# Altium project EE463_Project.PrjPcb
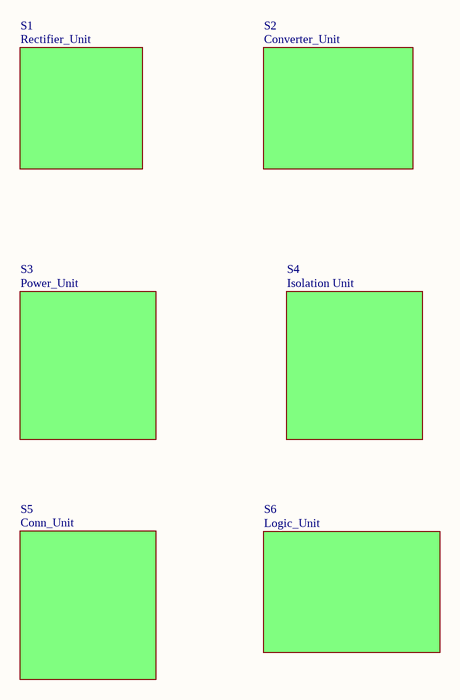
[diagram p0: EE463_Sch.SchDoc]
6 sheets, 40 parts. Net scope: flat (ports and power ports of the same name join across sheets).
Board file: EE463_PCB.PcbDoc
Sheets:
  EE463_Sch.SchDoc
    S2 = Converter_Unit.SchDoc
    S3 = Power_Unit.SchDoc
    S6 = Logic_Unit.SchDoc
    S5 = Conn_Unit.SchDoc
    S4 = Isolation Unit.SchDoc

## Sheet EE463_Sch.SchDoc
size A3

### Sub-sheets
S1 = Rectifier_Unit (file not in this document): no entries
S2 = Converter_Unit: no entries
S3 = Power_Unit: no entries
S4 = Isolation Unit: no entries
S5 = Conn_Unit: no entries
S6 = Logic_Unit: no entries

### Notes on the sheet
- Title
- Size:
- Date:
- A3
- Number:
- Time:
- Revision:
- Sheet
- of
- File:

## Sheet Converter_Unit.SchDoc
size A3
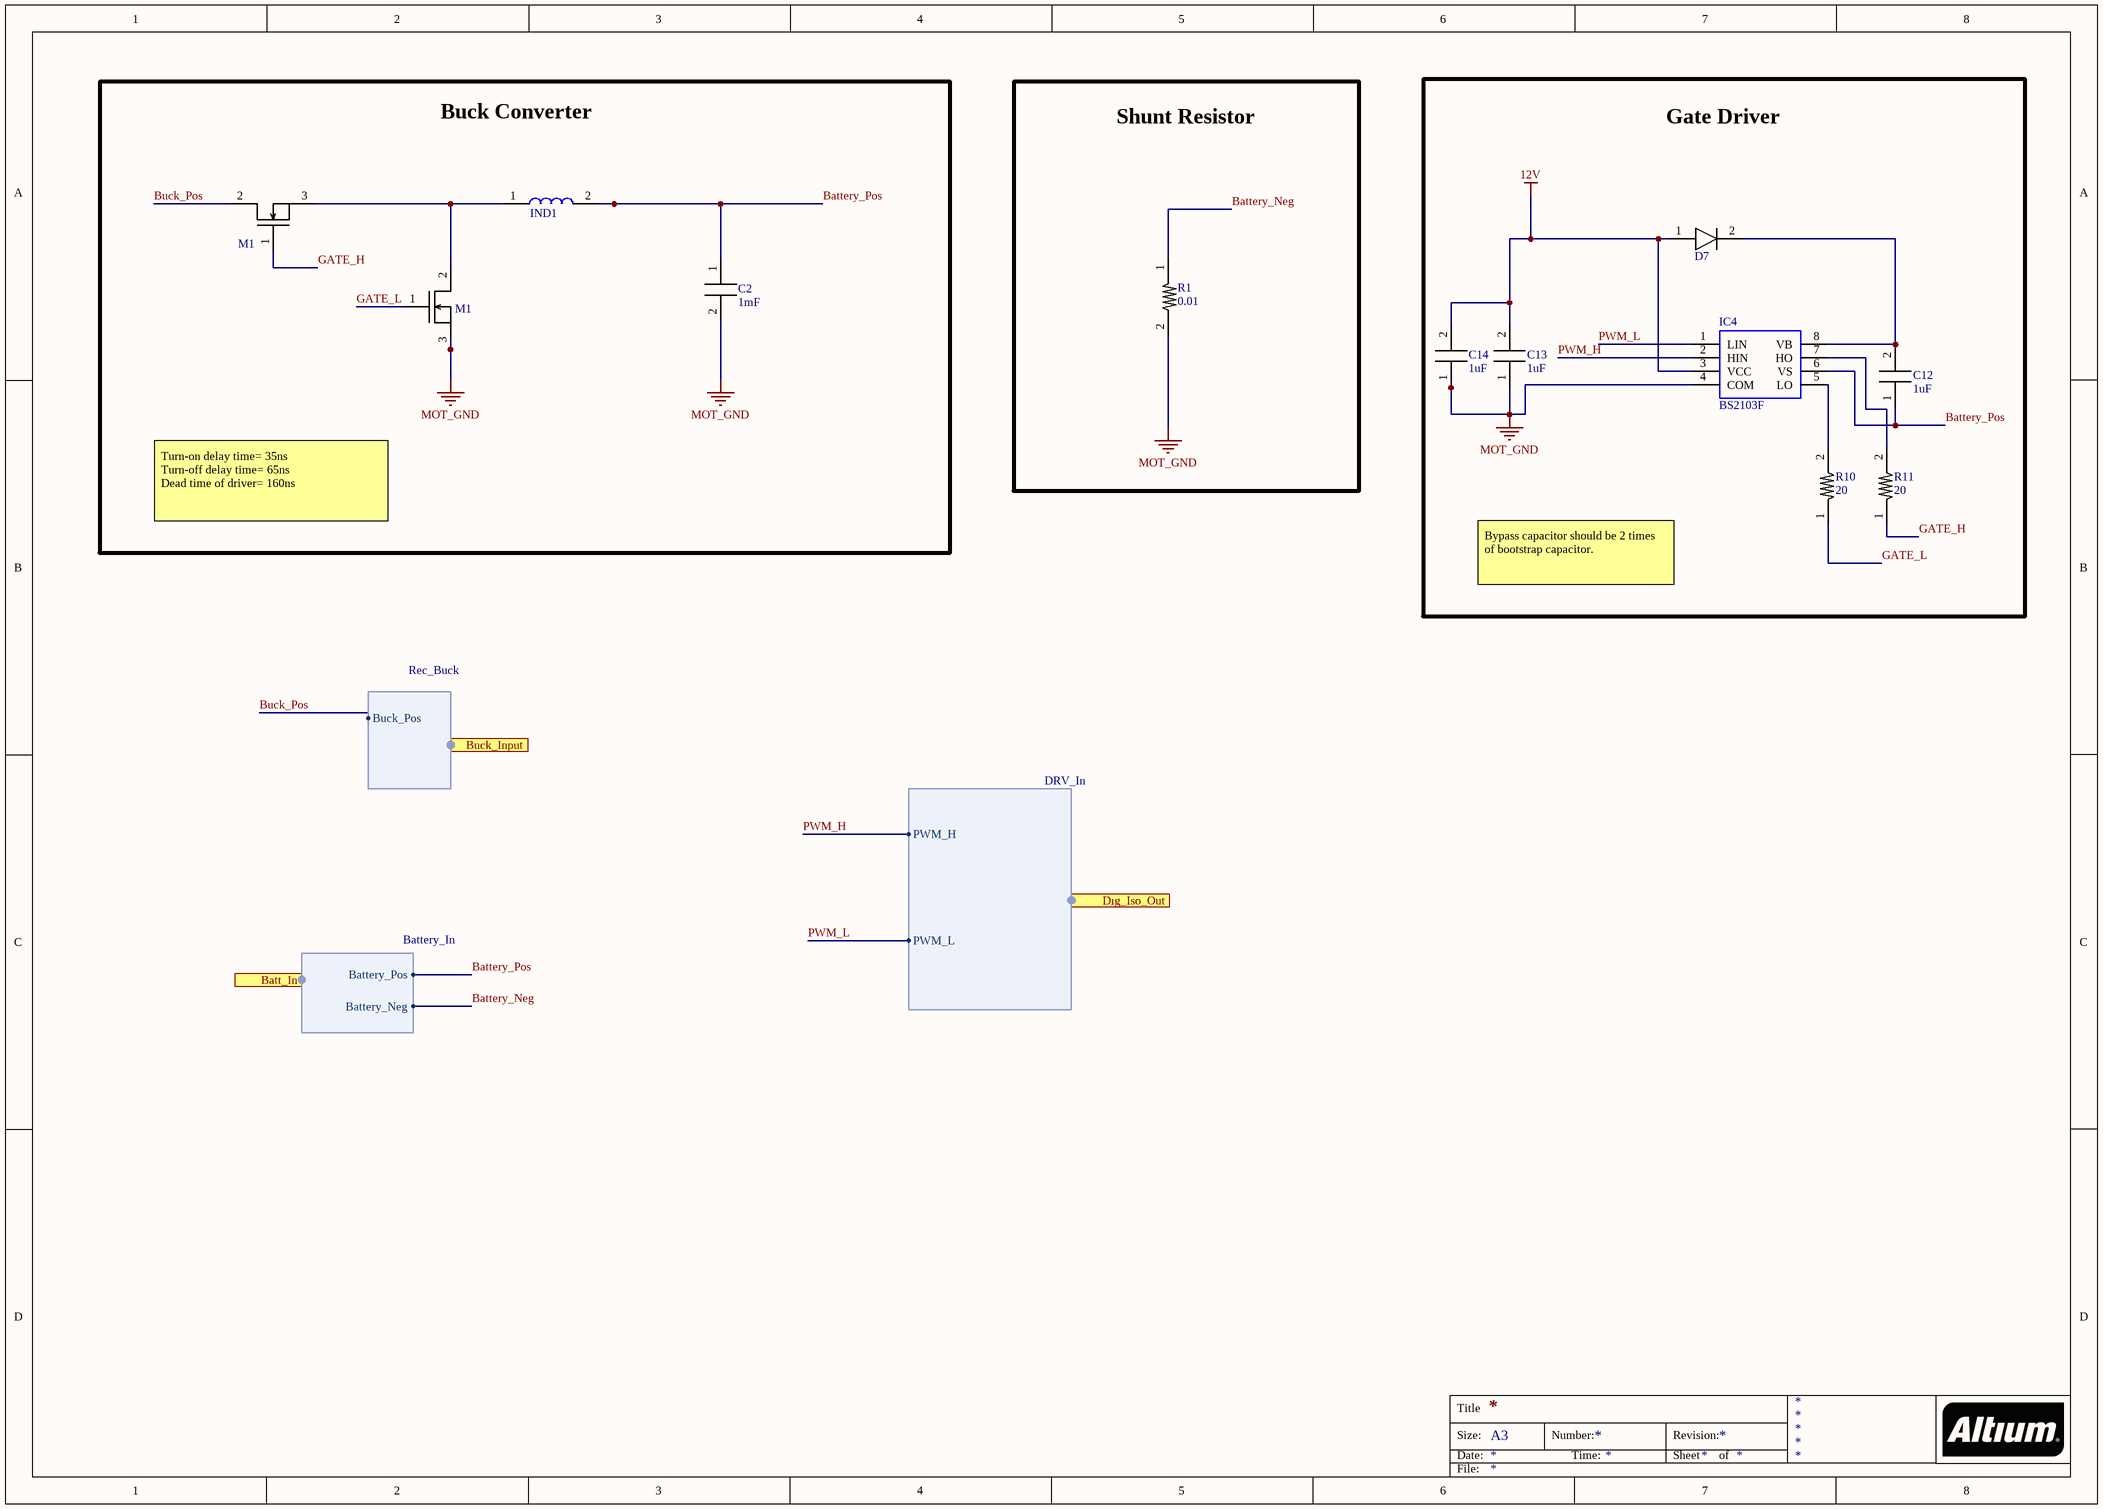
[diagram p1: Converter_Unit.SchDoc]

### Parts
*  M1
*?  M1
C2  Parameter 1: 1mF  (hidden comment: CAP 1mF UVK1V102MHD)
C12  Parameter 1: 1uF  (hidden comment: CAP 1uF)
C13  Parameter 1: 1uF  (hidden comment: CAP 1uF)
C14  Parameter 1: 1uF  (hidden comment: CAP 1uF)
D7  DI VS-10BQ030-M3/5BT  (value not drawn)
IC4  BS2103F  [BS2103F]
IND1  IND, 5mH, B82615B2202M001  (value not drawn)
R1  Parameter 1: 0.01  (hidden comment: RES, 0.01, 0402, Shunt)
R10  Parameter 1: 20  (hidden comment: RES, 20, 0603)
R11  Parameter 1: 20  (hidden comment: RES, 20, 0603)

### Ports
Batt_In (harness Battery_In), Buck_Input (harness Rec_Buck), Dıg_Iso_Out (harness DRV_In)

### Harnesses
Rec_Buck: Buck_Pos
Battery_In: Battery_Pos, Battery_Neg
DRV_In: PWM_H, PWM_L

### Nets
12V: C13.2 C14.2 D7.1(Anode) IC4.3(VCC)
MOT_GND: *?.3 C2.2 C13.1 C14.1 IC4.4(COM) R1.2
Battery_Neg: R1.1 ; port Batt_In.Battery_Neg
Battery_Pos: C2.1 C12.1 IC4.6(VS) IND1.2 ; port Batt_In.Battery_Pos
Buck_Pos: *.2 ; harness Rec_Buck.Buck_Pos
GATE_H: *.1 R11.1
GATE_L: *?.1 R10.1
PWM_H: IC4.2(HIN) ; port Dıg_Iso_Out.PWM_H
PWM_L: IC4.1(LIN) ; port Dıg_Iso_Out.PWM_L
Net*_3: *.3 *?.2 IND1.1
NetC12_2: C12.2 D7.2(Cathode) IC4.8(VB)
NetIC4_5: IC4.5(LO) R10.2
NetIC4_7: IC4.7(HO) R11.2

### Notes on the sheet
- Buck Converter
- Shunt Resistor
- Gate Driver
- Turn-on delay time= 35ns
  Turn-off delay time= 65ns
  Dead time of driver= 160ns
- Bypass capacitor should be 2 times of bootstrap capacitor.
- Title
- Size:
- Date:
- A3
- Number:
- Time:
- Revision:
- Sheet
- of
- File:

### Library data of the parts
* *? = MOS, N-CH, FDD5N550NZ: MOS, N-CH, FDD5N550NZ, 2A
C2 = CAP 1mF UVK1V102MHD: CAP, ELC, 1mF, UVK1V102MHD, 35V
D7 = DI VS-10BQ030-M3/5BT: 30V, 2A, SCHOTTKY
IC4 = IC DRV, HALF-B, BS2103F
IND1 = IND, 5mH, B82615B2202M001: IND, 5mH, B82615B2202M001, 250V, 2A
R1 = RES, 0.01, 0402, Shunt: RES, 0.01, 0402, Shunt, CSS0402FT10L0

## Sheet Power_Unit.SchDoc
size A3
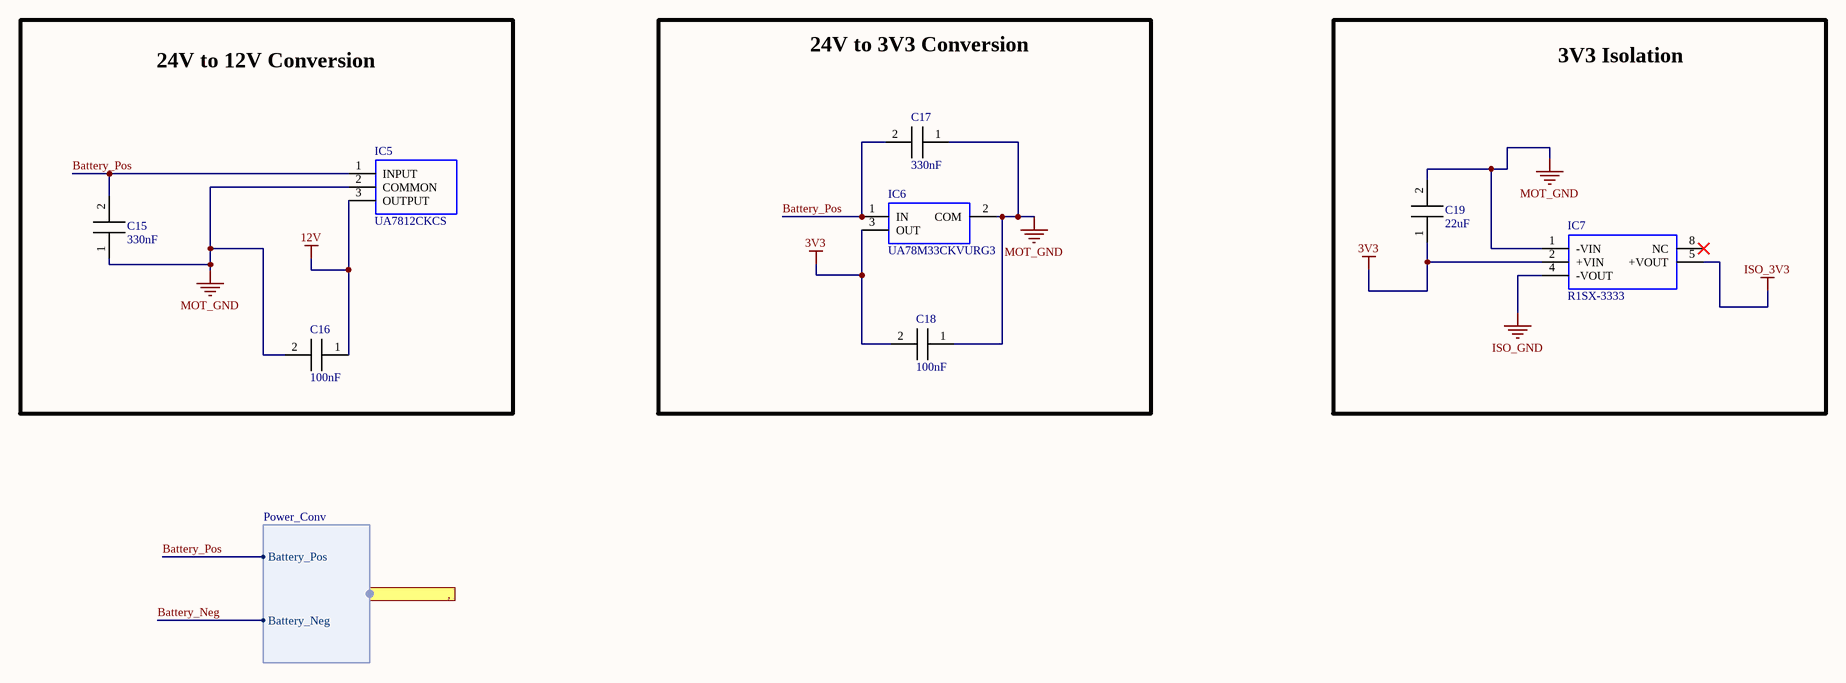
[diagram p2: Power_Unit.SchDoc]

### Parts
C15  Parameter 1: 330nF  (hidden comment: CAP 330nF)
C16  Parameter 1: 100nF  (hidden comment: CAP 100nF)
C17  Parameter 1: 330nF  (hidden comment: CAP 330nF)
C18  Parameter 1: 100nF  (hidden comment: CAP 100nF)
C19  Parameter 1: 22uF  (hidden comment: CAP  22uF)
IC5  UA7812CKCS  [UA7812CKCS]
IC6  UA78M33CKVURG3  [UA78M33CKVURG3]
IC7  R1SX-3333  [R1SX_3333]

### Ports
, (harness Power_Conv)

### Harnesses
Power_Conv: Battery_Pos, Battery_Neg

### Nets
3V3: C18.2 C19.1 IC6.3(OUT) IC7.2(+VIN)
12V: C16.1 IC5.3(OUTPUT)
ISO_3V3: IC7.5(+VOUT)
ISO_GND: IC7.4(-VOUT)
MOT_GND: C15.1 C16.2 C17.1 C18.1 C19.2 IC5.2(COMMON) IC6.2(COM) IC7.1(-VIN)
Battery_Neg: port ,.Battery_Neg
Battery_Pos: C15.2 C17.2 IC5.1(INPUT) IC6.1(IN) ; port ,.Battery_Pos

Not connected (* = marked no-connect by the designer): IC7 8(NC)*

### Notes on the sheet
- 24V to 12V Conversion
- (near C17) 24V to 3V3 Conversion
- 3V3 Isolation
- Title
- Size:
- Date:
- A3
- Number:
- Time:
- Revision:
- Sheet
- of
- File:

### Library data of the parts
IC5 = IC, LVR, UA7812CKCS
IC6 = IC, LVR, UA78M33CKVURG3, 24/3V3
IC7 = IC, DC/DC, ISO, R1SX-3333

## Sheet Logic_Unit.SchDoc
size A3
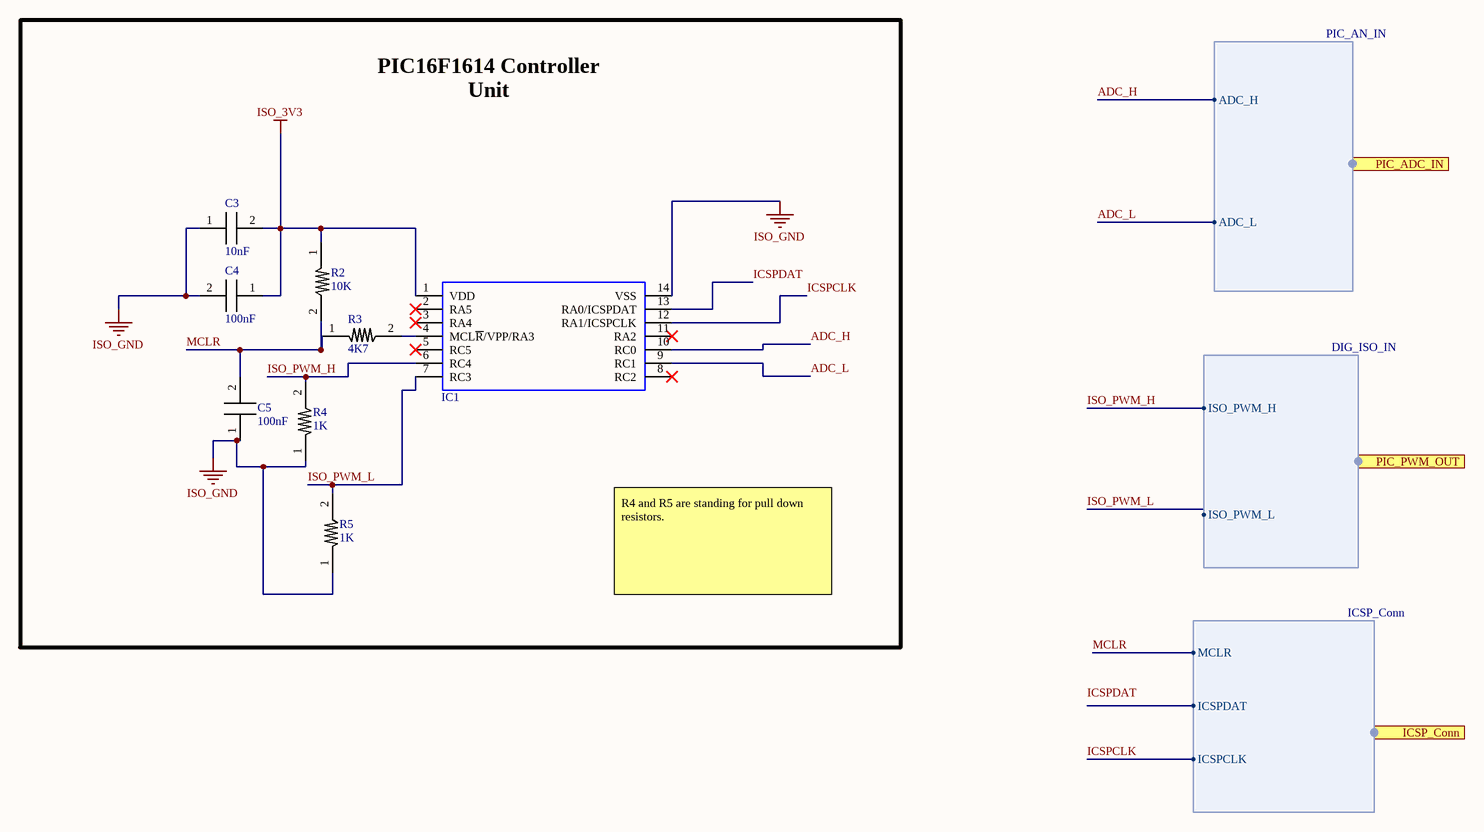
[diagram p3: Logic_Unit.SchDoc]

### Parts
C3  Parameter 1: 10nF  (hidden comment: CAP 10nF)
C4  Parameter 1: 100nF  (hidden comment: CAP 100nF)
C5  Parameter 1: 100nF  (hidden comment: CAP 100nF)
IC1  IC PIC16, PIC16F1614  [PIC16F1613]  (value not drawn)
R2  Parameter 1: 10K  (hidden comment: RES, 10K, 0603)
R3  Parameter 1: 4K7  (hidden comment: RES, 4K7, 0603)
R4  Parameter 1: 1K  (hidden comment: RES, 1K, 0603)
R5  Parameter 1: 1K  (hidden comment: RES, 1K, 0603)

### Ports
ICSP_Conn (harness ICSP_Conn), PIC_ADC_IN (harness PIC_AN_IN), PIC_PWM_OUT (harness DIG_ISO_IN)

### Harnesses
PIC_AN_IN: ADC_H, ADC_L
DIG_ISO_IN: ISO_PWM_H, ISO_PWM_L
ICSP_Conn: MCLR, ICSPDAT, ICSPCLK

### Nets
ISO_3V3: C3.2 C4.1 IC1.1(VDD) R2.1
ISO_GND: C3.1 C4.2 C5.1 IC1.14(VSS) R4.1 R5.1
ADC_H: IC1.10(RC0) ; port PIC_ADC_IN.ADC_H
ADC_L: IC1.9(RC1) ; port PIC_ADC_IN.ADC_L
ICSPCLK: IC1.12(RA1/ICSPCLK) ; port ICSP_Conn.ICSPCLK
ICSPDAT: IC1.13(RA0/ICSPDAT)
ISO_PWM_H: IC1.6(RC4) R4.2 ; port PIC_PWM_OUT.ISO_PWM_H
ISO_PWM_L: IC1.7(RC3) R5.2 ; port PIC_PWM_OUT.ISO_PWM_L
MCLR: C5.2 R2.2 R3.1 ; port ICSP_Conn.MCLR
NetIC1_4: IC1.4(MCL~{R}/VPP/RA3) R3.2

Not connected (* = marked no-connect by the designer): IC1 2(RA5)* 3(RA4)* 5(RC5)* 8(RC2)* 11(RA2)*

### Notes on the sheet
- PIC16F1614 Controller Unit
- R4 and R5 are standing for pull down resistors.
- Labels drawn without touching a wire or pin: ICSPDAT

## Sheet Conn_Unit.SchDoc
size A3

### Notes on the sheet
- Title
- Size:
- Date:
- A3
- Number:
- Time:
- Revision:
- Sheet
- of
- File:

## Sheet Isolation Unit.SchDoc
size A4
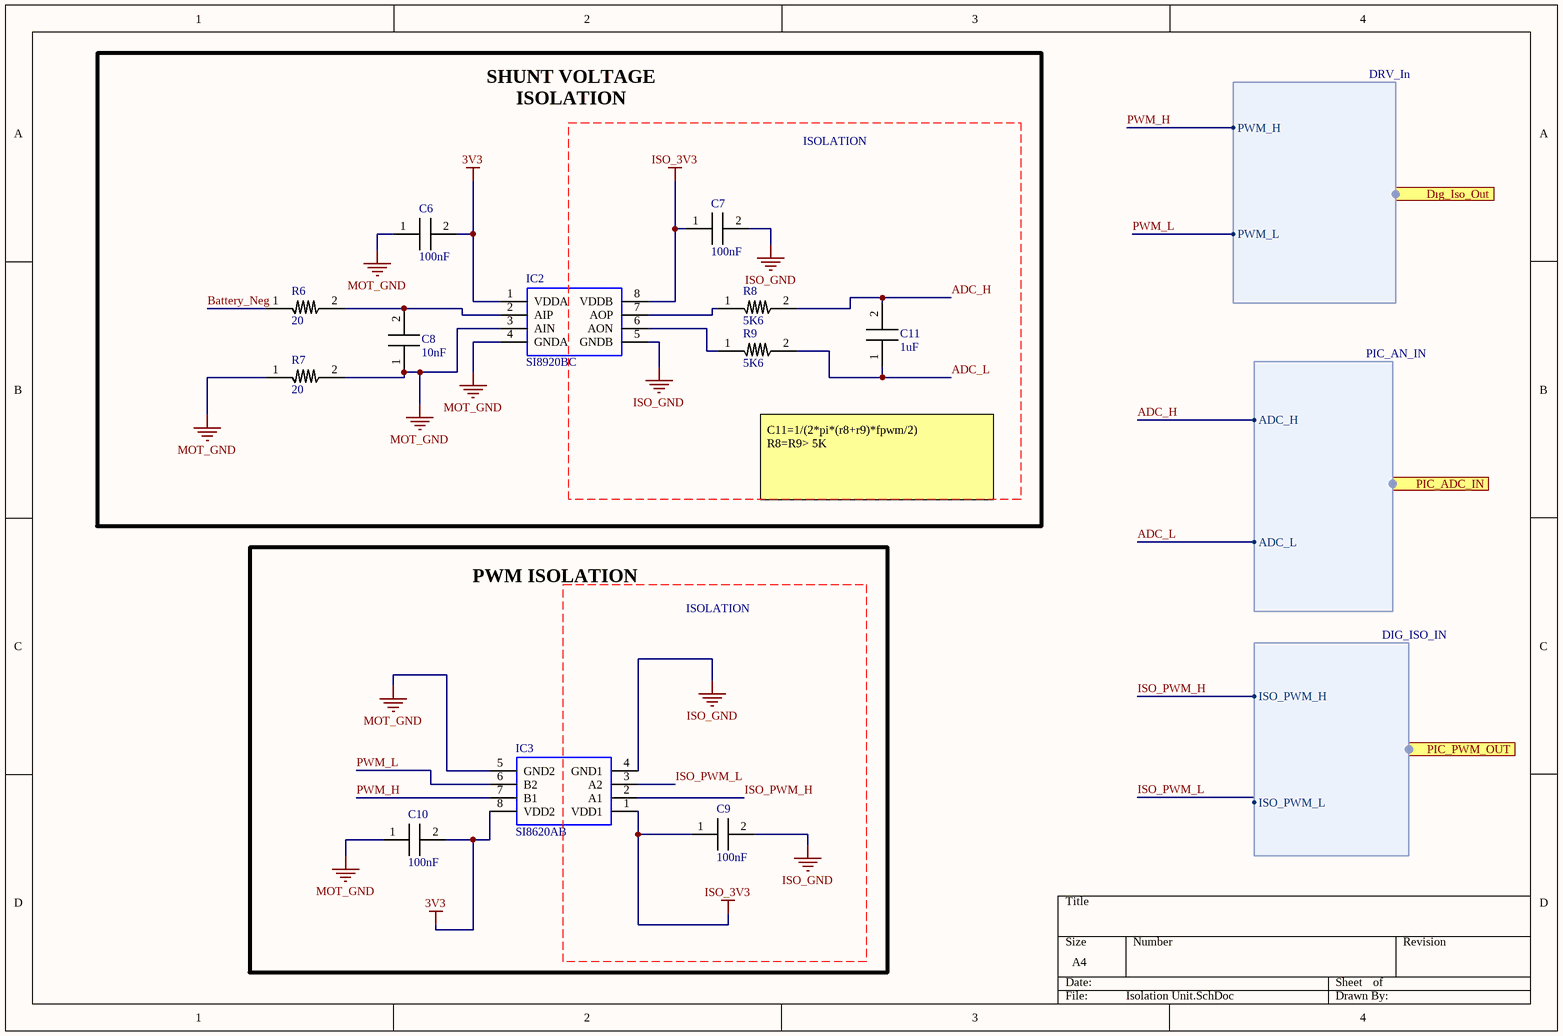
[diagram p4: Isolation Unit.SchDoc]

### Parts
C6  Parameter 1: 100nF  (hidden comment: CAP 100nF)
C7  Parameter 1: 100nF  (hidden comment: CAP 100nF)
C8  Parameter 1: 10nF  (hidden comment: CAP 10nF)
C9  Parameter 1: 100nF  (hidden comment: CAP 100nF)
C10  Parameter 1: 100nF  (hidden comment: CAP 100nF)
C11  Parameter 1: 1uF  (hidden comment: CAP 1uF)
IC2  SI8920BC  [SI8920BC-IP]
IC3  SI8620AB  [SI8620AB]
R6  Parameter 1: 20  (hidden comment: RES, 20, 0603)
R7  Parameter 1: 20  (hidden comment: RES, 20, 0603)
R8  Parameter 1: 5K6  (hidden comment: RES, 5K6, 0603)
R9  Parameter 1: 5K6  (hidden comment: RES, 5K6, 0603)

### Blocks framed on the sheet
ISOLATION: C6-C8 C11 IC2 R6-R9
ISOLATION: C9 C10 IC3

### Ports
Dıg_Iso_Out (harness DRV_In), PIC_ADC_IN (harness PIC_AN_IN), PIC_PWM_OUT (harness DIG_ISO_IN)

### Harnesses
DRV_In: PWM_H, PWM_L
PIC_AN_IN: ADC_H, ADC_L
DIG_ISO_IN: ISO_PWM_H, ISO_PWM_L

### Nets
3V3: C6.2 C10.2 IC2.1(VDDA) IC3.8(VDD2)
ISO_3V3: C7.1 C9.1 IC2.8(VDDB) IC3.1(VDD1)
ISO_GND: C7.2 C9.2 IC2.5(GNDB) IC3.4(GND1)
MOT_GND: C6.1 C8.1 C10.1 IC2.3(AIN) IC2.4(GNDA) IC3.5(GND2) R7.1 R7.2
ADC_H: C11.2 R8.2 ; port PIC_ADC_IN.ADC_H
ADC_L: C11.1 R9.2 ; port PIC_ADC_IN.ADC_L
Battery_Neg: R6.1
ISO_PWM_H: IC3.2(A1) ; port PIC_PWM_OUT.ISO_PWM_H
ISO_PWM_L: IC3.3(A2) ; port PIC_PWM_OUT.ISO_PWM_L
PWM_H: IC3.7(B1) ; port Dıg_Iso_Out.PWM_H
PWM_L: IC3.6(B2) ; port Dıg_Iso_Out.PWM_L
NetC8_2: C8.2 IC2.2(AIP) R6.2
NetIC2_6: IC2.6(AON) R9.1
NetIC2_7: IC2.7(AOP) R8.1

### Notes on the sheet
- SHUNT VOLTAGE ISOLATION
- C11=1/(2*pi*(r8+r9)*fpwm/2)
  R8=R9> 5K
- PWM ISOLATION

### Library data of the parts
IC2 = IC ISO OP-AMP,SI8920BC
IC3 = IC ISO DIG, SI8620AB

## Nets that join several sheets
3V3: Power_Unit (C18.2 C19.1 IC6.3 IC7.2), Isolation Unit (C6.2 C10.2 IC2.1 IC3.8)
12V: Converter_Unit (C13.2 C14.2 D7.1 IC4.3), Power_Unit (C16.1 IC5.3)
ISO_3V3: Power_Unit (IC7.5), Logic_Unit (C3.2 C4.1 IC1.1 R2.1), Isolation Unit (C7.1 C9.1 IC2.8 IC3.1)
ISO_GND: Power_Unit (IC7.4), Logic_Unit (6 pins), Isolation Unit (C7.2 C9.2 IC2.5 IC3.4)
MOT_GND: Converter_Unit (6 pins), Power_Unit (8 pins), Isolation Unit (8 pins)
ADC_H: Logic_Unit (IC1.10), Isolation Unit (C11.2 R8.2)
ADC_L: Logic_Unit (IC1.9), Isolation Unit (C11.1 R9.2)
ISO_PWM_H: Logic_Unit (IC1.6 R4.2), Isolation Unit (IC3.2)
ISO_PWM_L: Logic_Unit (IC1.7 R5.2), Isolation Unit (IC3.3)
PWM_H: Converter_Unit (IC4.2), Isolation Unit (IC3.7)
PWM_L: Converter_Unit (IC4.1), Isolation Unit (IC3.6)